# EAGLE schematic basic logging sensor (EAGLE 5.03)
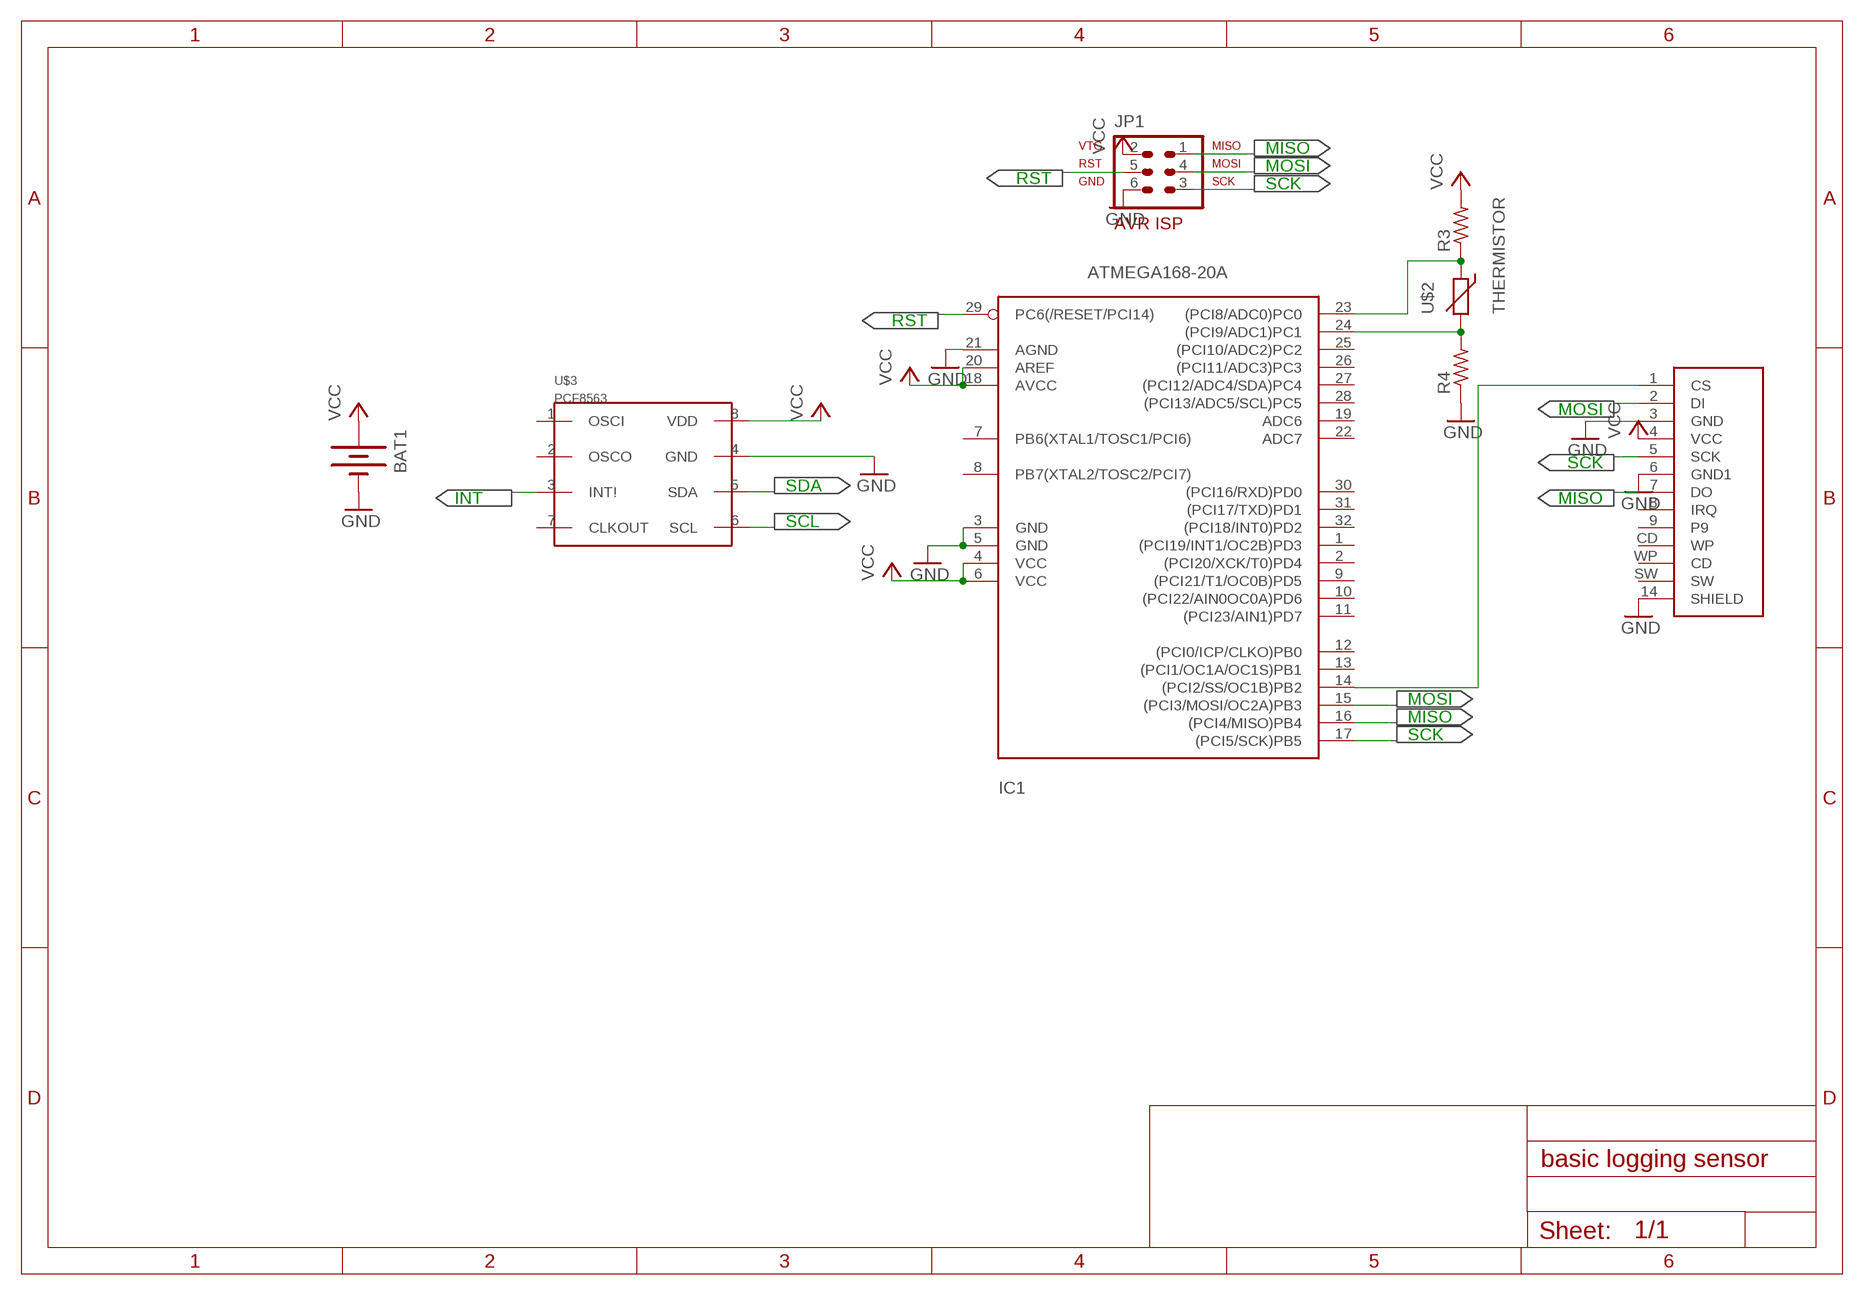
[diagram p0: schematic, sheet 1]

## Parts
BAT1  BATTERY20SMD  [BATTCON_20MM]
IC1  ATMEGA168-20A  [TQFP32-08]
JP1  AVR-ISP-6  [AVR-ISP-6]
R3  R-US_R0603  [R0603]
R4  R-US_R0603  [R0603]
U$1  SD_CARD_SOCKETSD  [SD-MMC_SOCKET-PP]
U$2  THERMISTOR  [0603]
U$3  PCF8563  [SO8]

## Nets
GND: BAT1.2(-) IC1.3(GND) IC1.5(GND) IC1.21(AGND) JP1.6 R4.1 U$1.3(GND) U$1.6(GND1) U$1.14(SHIELD) U$3.4(GND)
MISO: IC1.16((PCI4/MISO)PB4) JP1.1 U$1.7(DO)
MOSI: IC1.15((PCI3/MOSI/OC2A)PB3) JP1.4 U$1.2(DI)
N$1: IC1.14((PCI2/SS/OC1B)PB2) U$1.1(CS)
N$2: U$3.3(INT!)
N$13: IC1.23((PCI8/ADC0)PC0) R3.1 U$2.1
N$14: IC1.24((PCI9/ADC1)PC1) R4.2 U$2.2
RST: IC1.29(PC6(/RESET/PCI14)) JP1.5
SCK: IC1.17((PCI5/SCK)PB5) JP1.3 U$1.5(SCK)
SCL: U$3.6(SCL)
SDA: U$3.5(SDA)
VCC: BAT1.1(+) IC1.4(VCC) IC1.6(VCC) IC1.18(AVCC) IC1.20(AREF) JP1.2 R3.2 U$1.4(VCC) U$3.8(VDD)
Unconnected: IC1.1((PCI19/INT1/OC2B)PD3) IC1.2((PCI20/XCK/T0)PD4) IC1.7(PB6(XTAL1/TOSC1/PCI6)) IC1.8(PB7(XTAL2/TOSC2/PCI7)) IC1.9((PCI21/T1/OC0B)PD5) IC1.10((PCI22/AIN0OC0A)PD6) IC1.11((PCI23/AIN1)PD7) IC1.12((PCI0/ICP/CLKO)PB0) IC1.13((PCI1/OC1A/OC1S)PB1) IC1.19(ADC6) IC1.22(ADC7) IC1.25((PCI10/ADC2)PC2) IC1.26((PCI11/ADC3)PC3) IC1.27((PCI12/ADC4/SDA)PC4) IC1.28((PCI13/ADC5/SCL)PC5) IC1.30((PCI16/RXD)PD0) IC1.31((PCI17/TXD)PD1) IC1.32((PCI18/INT0)PD2) U$1.8(IRQ) U$1.9 U$1.CD(WP) U$1.SW U$1.WP(CD) U$3.1(OSCI) U$3.2(OSCO) U$3.7(CLKOUT)

## Notes on the sheet
- MISO
- RST | MOSI
- SCK
- RST
- MOSI
- SCK
- INT | SDA | MISO
- SCL
- MOSI
- MISO
- SCK

## Library data of the parts
BAT1 = SparkFun:BATTERY: Battery Holders Various common sizes : AA, AAA, 20mm coin cell and 12mm coin cell.
IC1 = avr:ATMEGA168: MICROCONTROLLER 16 kBytes FLASH 1 kBytes SRAM 512 Bytes EEPROM USART 8-channel 10 bit ADC
JP1 = atmel-1:AVR-ISP-6: AVR ISP-6 Serial Programming Header
R3 R4 = rcl:R-US_: RESISTOR, American symbol
U$1 = SparkFun:SD_CARD_SOCKET: SD/MMC Socket Media socket for SD and MMC cards. Push-push type. Schematic element and footprint production proven. Spark Fun Electronics SKU : PRT-00136
U$2 = nublabs:THERMISTOR
U$3 = nublabs:PCF8563